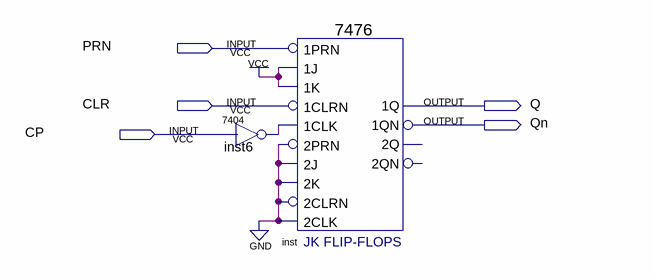
[diagram p0: schematic sheet]
// Quartus schematic Problem8B.bdf as structural Verilog: 2 symbols, 5 pins
module Problem8B (
  input  PRN,
  input  CLR,
  input  CP,
  output Q,
  output Qn
);

  wire inst6_1;

  \7404  inst6 (.\2 (CP), .\1 (inst6_1));
  \7476  inst (
    .\1J (1'b1), .\1K (1'b1), .\1PRN (PRN), .\2PRN (1'b0), .\2J (1'b0), .\1CLK (inst6_1), .\1CLRN (CLR),
    .\2K (1'b0), .\2CLRN (1'b0), .\2CLK (1'b0), .\1Q (Q), .\1QN (Qn));  // open: 2QN, 2Q
endmodule
